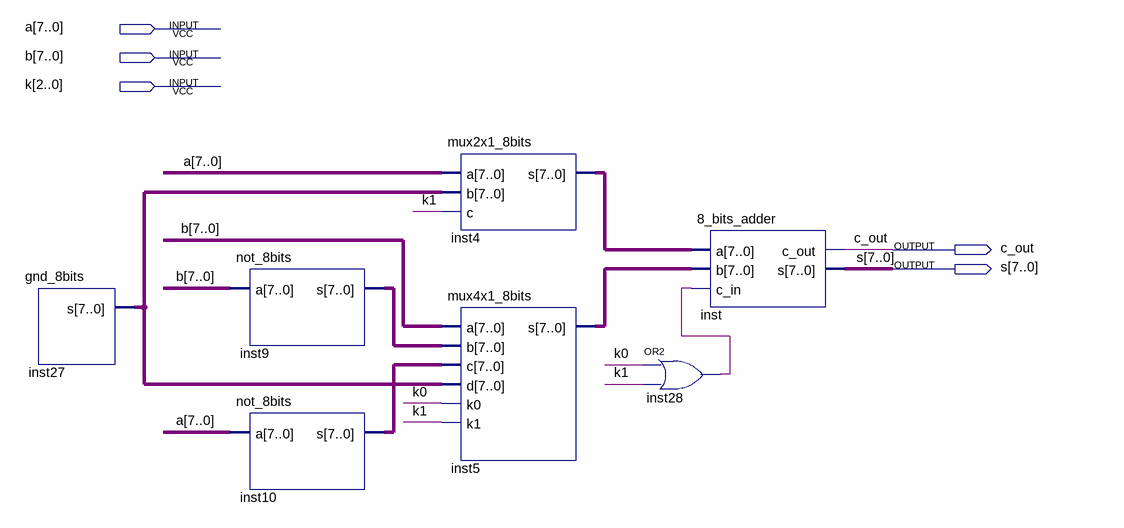
[diagram p0: schematic sheet]
// Quartus schematic add_sub_neg.bdf as structural Verilog: 7 symbols, 5 pins
module add_sub_neg (
  input  [7:0] a,
  input  [7:0] b,
  input  [2:0] k,
  output c_out,
  output [7:0] s
);

  wire inst28_out;
  wire [7:0] inst4_s, inst5_s, inst9_s, inst10_s, inst27_s;

  gnd_8bits inst27 (.s(inst27_s));
  not_8bits inst9 (.a(b), .s(inst9_s));
  not_8bits inst10 (.a(a), .s(inst10_s));
  mux2x1_8bits inst4 (.a(a), .b(inst27_s), .c(k[1]), .s(inst4_s));
  mux4x1_8bits inst5 (.a(b), .b(inst9_s), .c(inst10_s), .d(inst27_s), .k0(k[0]), .k1(k[1]), .s(inst5_s));
  or inst28 (inst28_out, k[0], k[1]);
  \8_bits_adder  inst (.a(inst4_s), .b(inst5_s), .c_in(inst28_out), .c_out(c_out), .s(s));
endmodule
